# EAGLE schematic MotorControl_M (EAGLE 9.6.2)

## Sheet 1 of 2
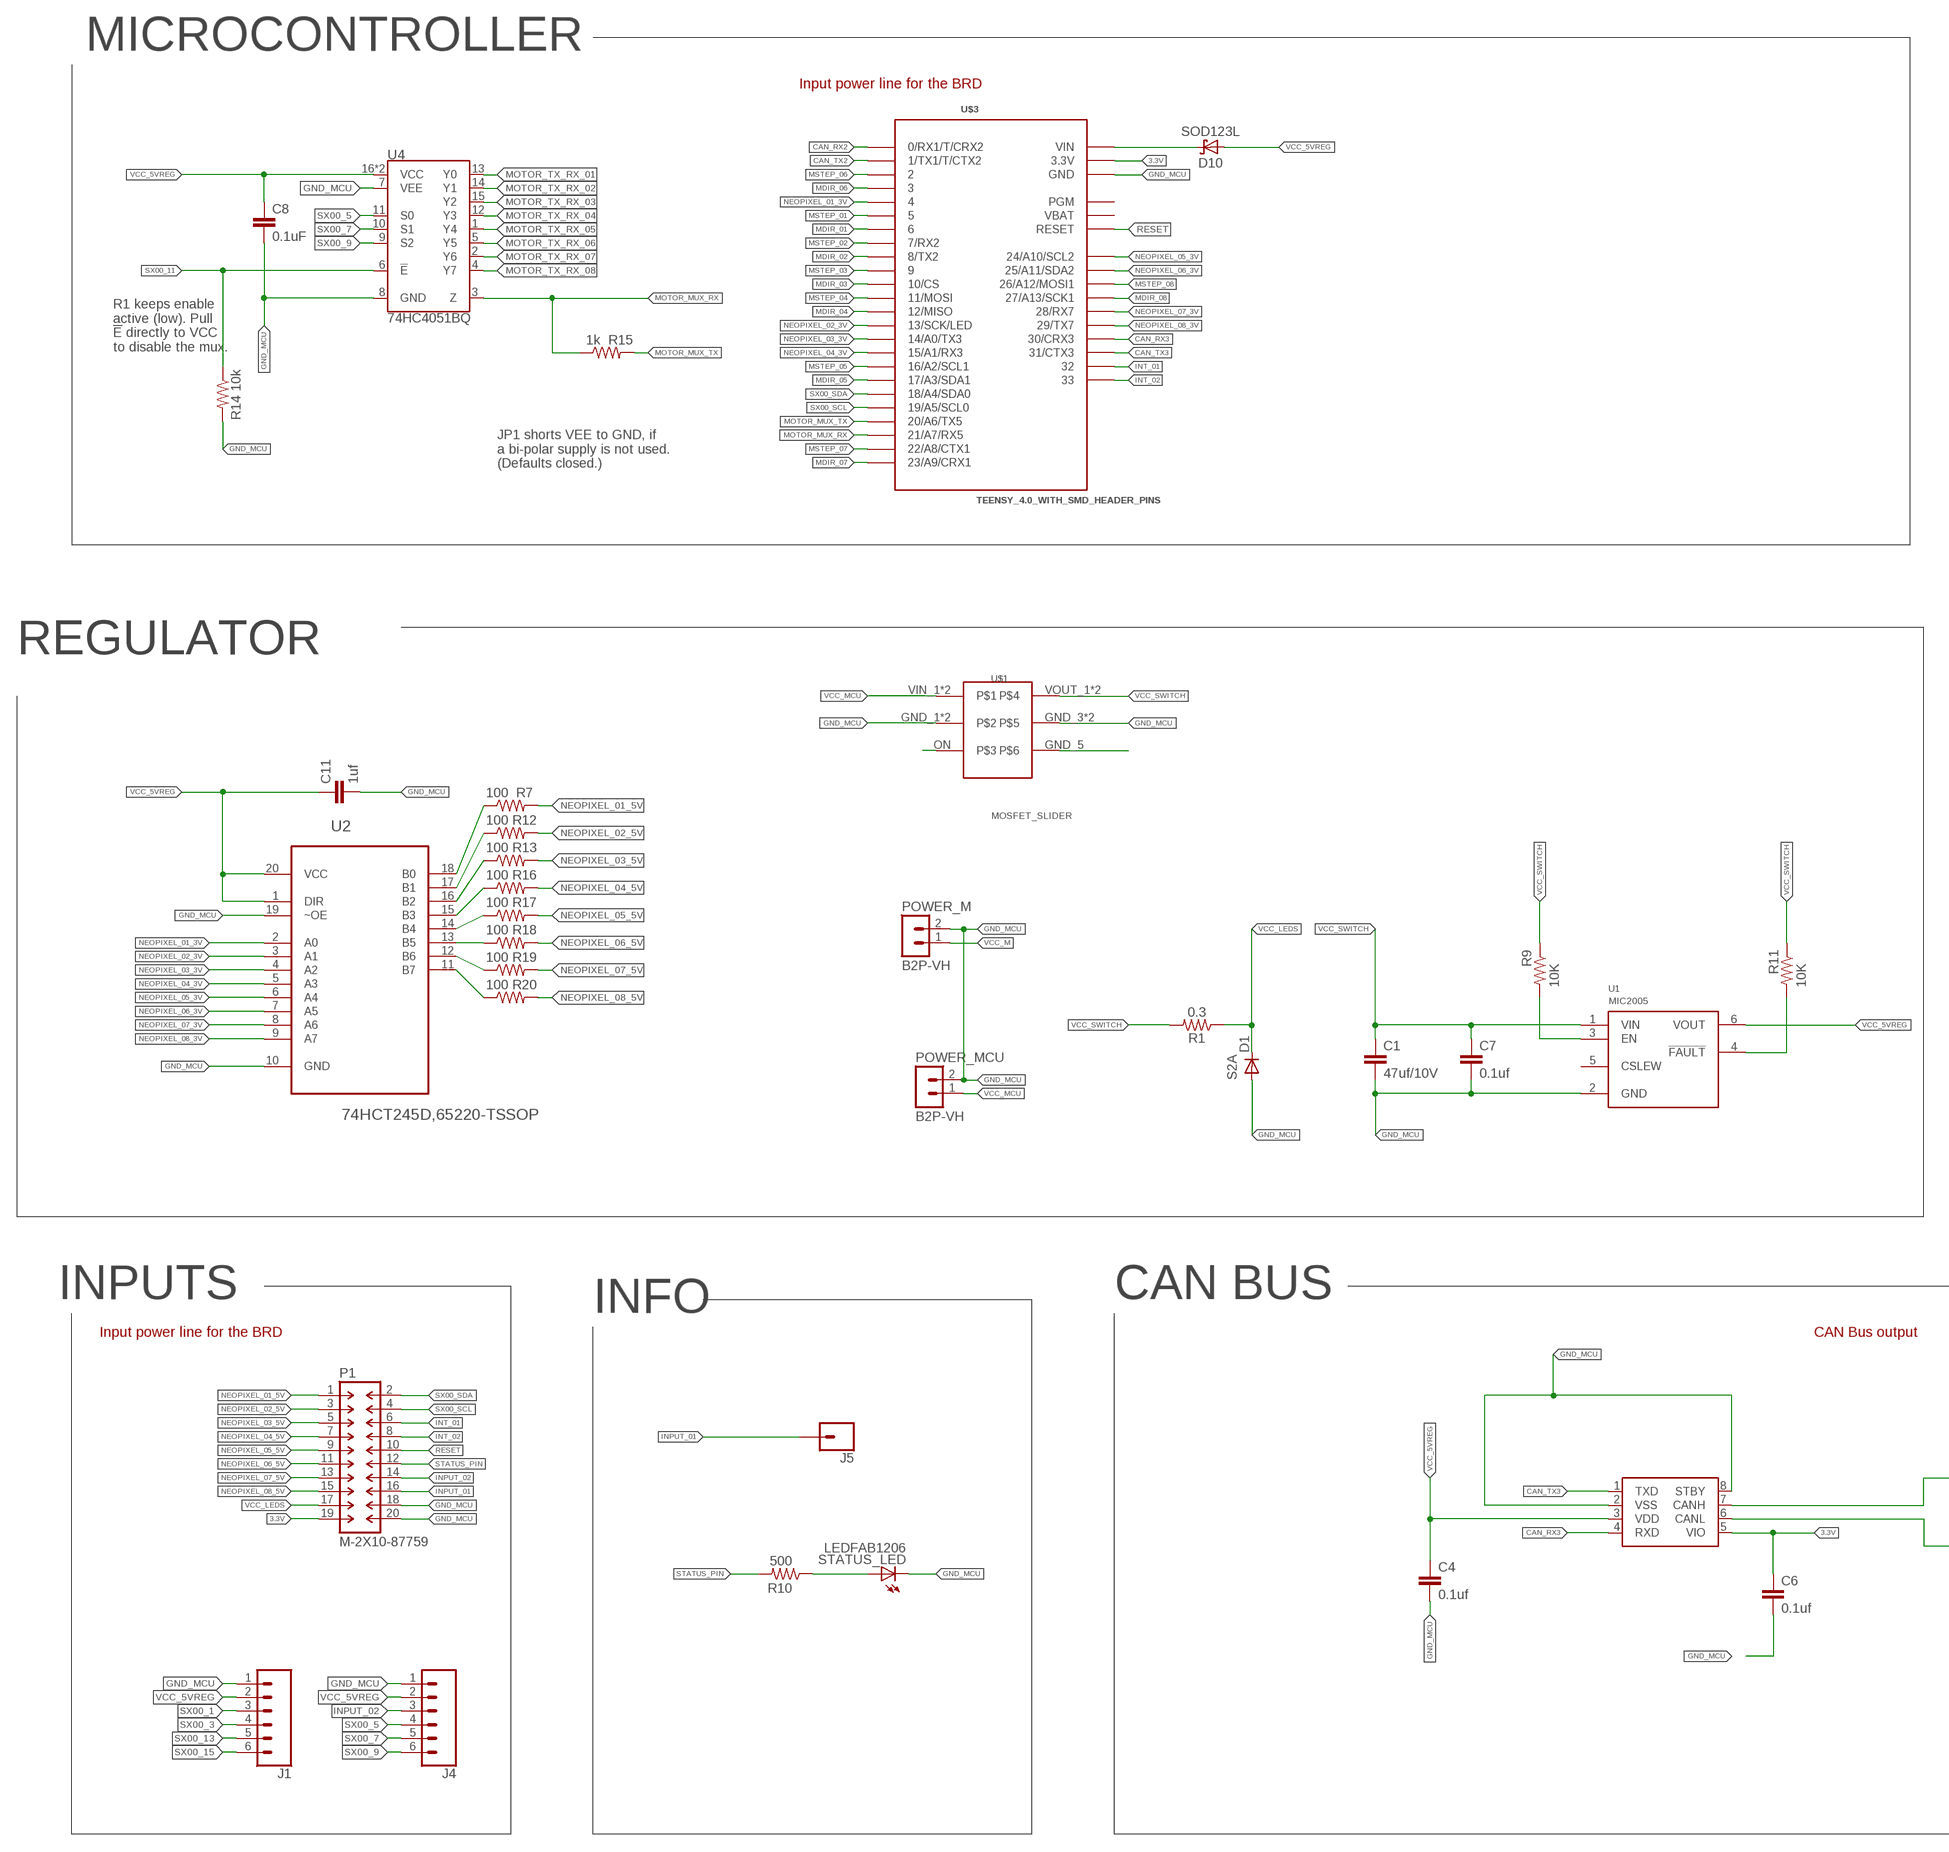
[diagram p0: schematic, sheet 1, part 1 of 3]
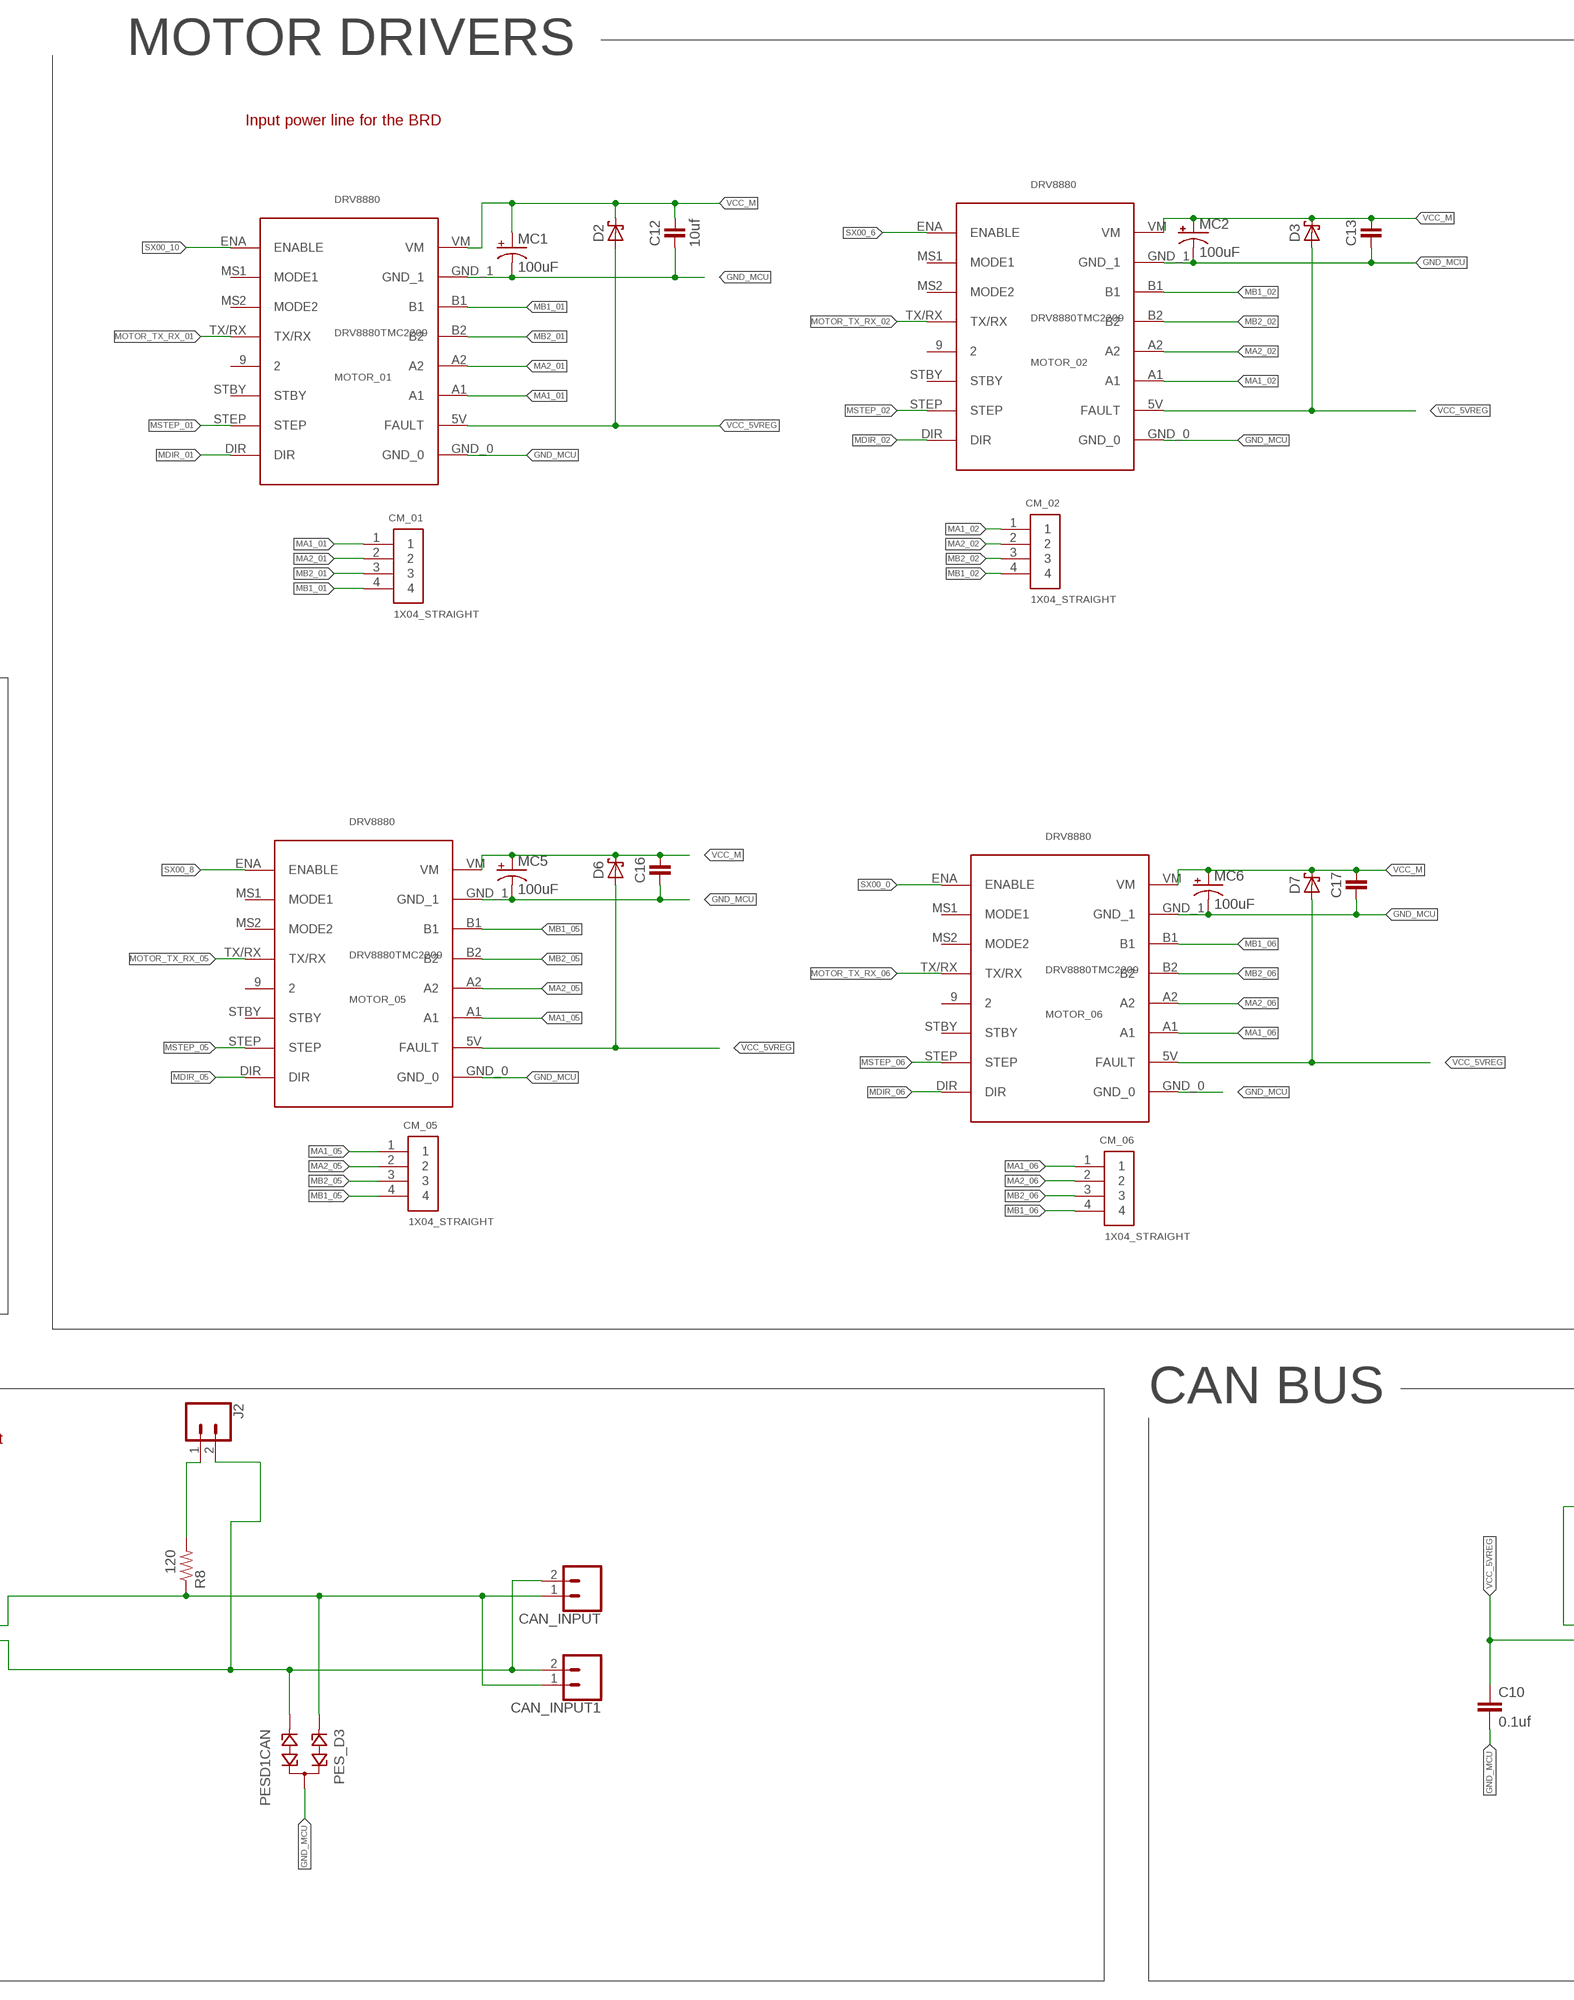
[diagram p1: schematic, sheet 1, part 2 of 3]
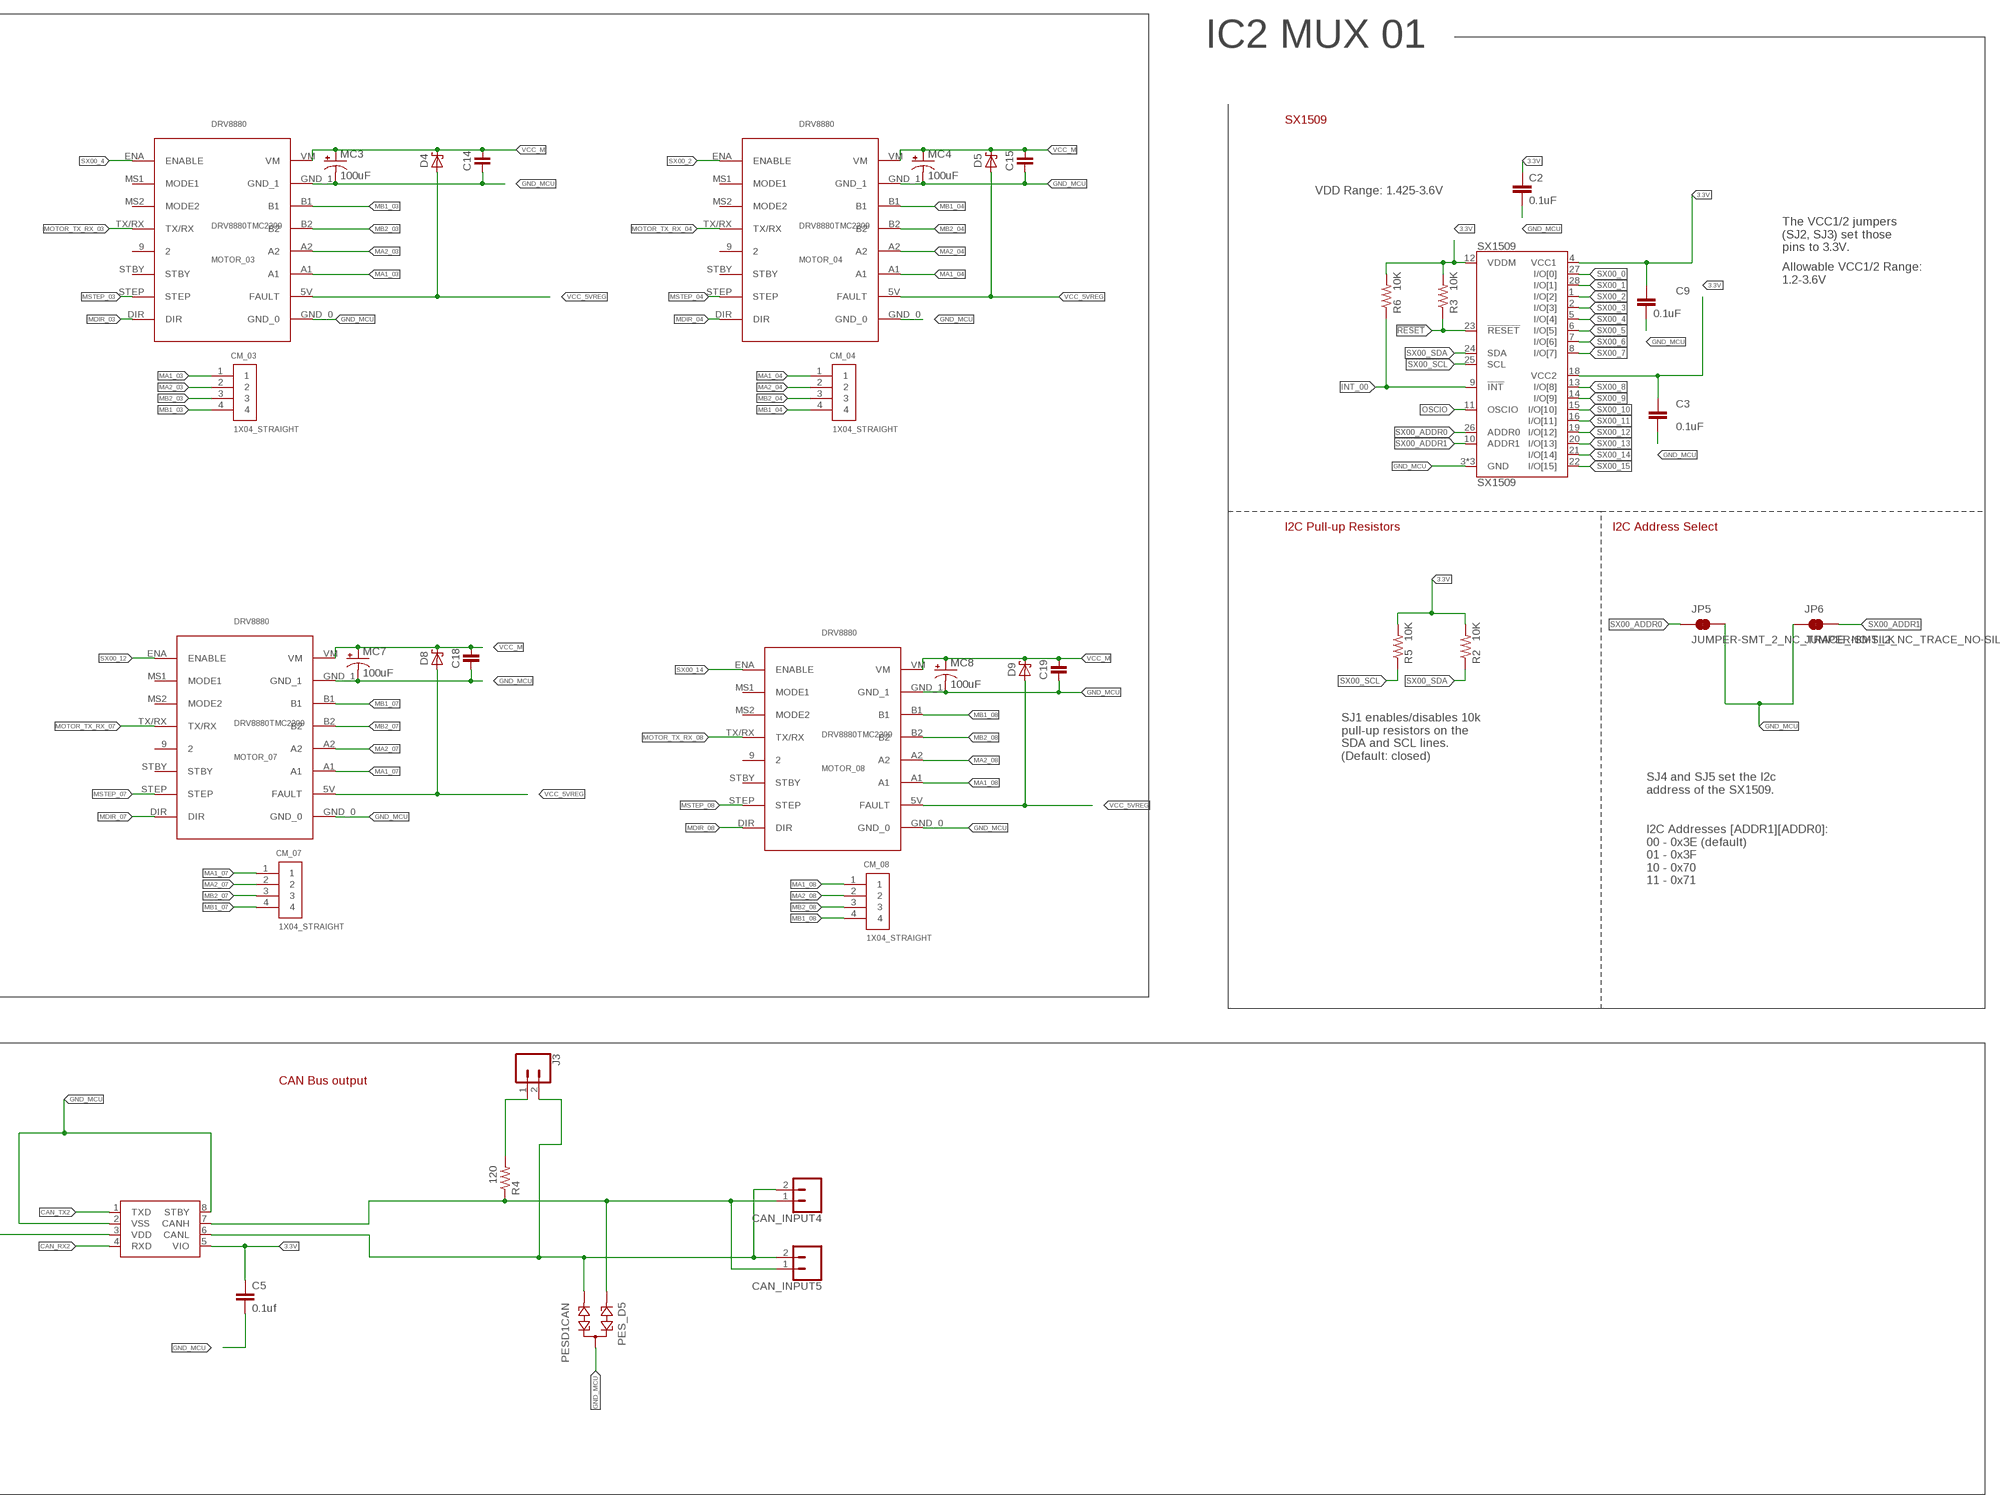
[diagram p2: schematic, sheet 1, part 3 of 3]

### Parts
C1  47uf/10V  0.1UF-25V(+80/-20%)(0603)  [0603-CAP]
C2  0.1uF  0.1UF-25V(+80/-20%)(0603)  [0603-CAP]
C3  0.1uF  0.1UF-25V(+80/-20%)(0603)  [0603-CAP]
C4  0.1uf  0.1UF-25V(+80/-20%)(0603)  [0603-CAP]
C5  0.1uf  0.1UF-25V(+80/-20%)(0603)  [0603-CAP]
C6  0.1uf  0.1UF-25V(+80/-20%)(0603)  [0603-CAP]
C7  0.1uf  0.1UF-25V(+80/-20%)(0603)  [0603-CAP]
C8  0.1uF  0.1UF-0603-25V-(+80/-20%)  [0603]
C9  0.1uF  0.1UF-25V(+80/-20%)(0603)  [0603-CAP]
C10  0.1uf  0.1UF-25V(+80/-20%)(0603)  [0603-CAP]
C11  1uf  0.1UF-25V(+80/-20%)(0603)  [0603-CAP]
C12  10uf  CAPACITOR-1210  [C1210]
C13  CAPACITOR-1210  [C1210]
C14  CAPACITOR-1210  [C1210]
C15  CAPACITOR-1210  [C1210]
C16  CAPACITOR-1210  [C1210]
C17  CAPACITOR-1210  [C1210]
C18  CAPACITOR-1210  [C1210]
C19  CAPACITOR-1210  [C1210]
CAN_INPUT  CONN_02-JST-2MM-SMT  [JST-2-SMD]
CAN_INPUT1  CONN_02-JST-2MM-SMT  [JST-2-SMD]
CAN_INPUT4  CONN_02-JST-2MM-SMT  [JST-2-SMD]
CAN_INPUT5  CONN_02-JST-2MM-SMT  [JST-2-SMD]
CM_01  1X04_STRAIGHT  1X4-CLEANBIG  [1X04-CLEANBIG]
CM_02  1X04_STRAIGHT  1X4-CLEANBIG  [1X04-CLEANBIG]
CM_03  1X04_STRAIGHT  1X4-CLEANBIG  [1X04-CLEANBIG]
CM_04  1X04_STRAIGHT  1X4-CLEANBIG  [1X04-CLEANBIG]
CM_05  1X04_STRAIGHT  1X4-CLEANBIG  [1X04-CLEANBIG]
CM_06  1X04_STRAIGHT  1X4-CLEANBIG  [1X04-CLEANBIG]
CM_07  1X04_STRAIGHT  1X4-CLEANBIG  [1X04-CLEANBIG]
CM_08  1X04_STRAIGHT  1X4-CLEANBIG  [1X04-CLEANBIG]
D1  S2A  [DO214AA]
D2  D_SCHOTTKY-SOD123  [SOD123]
D3  D_SCHOTTKY-SOD123  [SOD123]
D4  D_SCHOTTKY-SOD123  [SOD123]
D5  D_SCHOTTKY-SOD123  [SOD123]
D6  D_SCHOTTKY-SOD123  [SOD123]
D7  D_SCHOTTKY-SOD123  [SOD123]
D8  D_SCHOTTKY-SOD123  [SOD123]
D9  D_SCHOTTKY-SOD123  [SOD123]
D10  SOD123L  D_SCHOTTKY-SOD123  [SOD123]
J1  CONN_06SMD-1MM  [1X06-1MM]
J2  CONN_02  [1X02]
J3  CONN_02  [1X02]
J4  CONN_06SMD-1MM  [1X06-1MM]
J5  CONN_01  [1X01]
JP5  JUMPER-SMT_2_NC_TRACE_NO-SILK  [SMT-JUMPER_2_NC_TRACE_NO-SILK]
JP6  JUMPER-SMT_2_NC_TRACE_NO-SILK  [SMT-JUMPER_2_NC_TRACE_NO-SILK]
MC1  100uF  100UF-POLAR-25V-20%(ELEC)  [PANASONIC_D]
MC2  100uF  100UF-POLAR-25V-20%(ELEC)  [PANASONIC_D]
MC3  100uF  100UF-POLAR-25V-20%(ELEC)  [PANASONIC_D]
MC4  100uF  100UF-POLAR-25V-20%(ELEC)  [PANASONIC_D]
MC5  100uF  100UF-POLAR-25V-20%(ELEC)  [PANASONIC_D]
MC6  100uF  100UF-POLAR-25V-20%(ELEC)  [PANASONIC_D]
MC7  100uF  100UF-POLAR-25V-20%(ELEC)  [PANASONIC_D]
MC8  100uF  100UF-POLAR-25V-20%(ELEC)  [PANASONIC_D]
MCP2562_2.0  MCP2562-E/SN  [SOIC127P600X175-8N]
MCP2562FD  MCP2562-E/SN  [SOIC127P600X175-8N]
MOTOR_01  DRV8880TMC2209  [TMC2209_SMD]
MOTOR_02  DRV8880TMC2209  [TMC2209_SMD]
MOTOR_03  DRV8880TMC2209  [TMC2209_SMD]
MOTOR_04  DRV8880TMC2209  [TMC2209_SMD]
MOTOR_05  DRV8880TMC2209  [TMC2209_SMD]
MOTOR_06  DRV8880TMC2209  [TMC2209_SMD]
MOTOR_07  DRV8880TMC2209  [TMC2209_SMD]
MOTOR_08  DRV8880TMC2209  [TMC2209_SMD]
P1  M-2X10-87759  [87759-20]
PES_D3  PESD1CAN  [SOT23]
PES_D5  PESD1CAN  [SOT23]
POWER_M  B2P-VH  [B2P-VH]
POWER_MCU  B2P-VH  [B2P-VH]
R1  0.3  0.3OHM-0805-1/8W-1%  [0805]
R2  10K  10KOHM-1/10W-1%(0603)0603  [0603-RES]
R3  10K  10KOHM-1/10W-1%(0603)0603  [0603-RES]
R4  120  10KOHM-1/10W-1%(0603)0603  [0603-RES]
R5  10K  10KOHM-1/10W-1%(0603)0603  [0603-RES]
R6  10K  10KOHM-1/10W-1%(0603)0603  [0603-RES]
R7  100  10KOHM-0603-1/10W-1%  [0603]
R8  120  10KOHM-1/10W-1%(0603)0603  [0603-RES]
R9  10K  10KOHM-1/10W-1%(0603)0603  [0603-RES]
R10  500  10KOHM-1/10W-1%(0603)0603  [0603-RES]
R11  10K  10KOHM-1/10W-1%(0603)0603  [0603-RES]
R12  100  10KOHM-0603-1/10W-1%  [0603]
R13  100  10KOHM-0603-1/10W-1%  [0603]
R14  10k  10KOHM-0603-1/10W-1%  [0603]
R15  1k  10KOHM-0603-1/10W-1%  [0603]
R16  100  10KOHM-0603-1/10W-1%  [0603]
R17  100  10KOHM-0603-1/10W-1%  [0603]
R18  100  10KOHM-0603-1/10W-1%  [0603]
R19  100  10KOHM-0603-1/10W-1%  [0603]
R20  100  10KOHM-0603-1/10W-1%  [0603]
STATUS_LED  LEDFAB1206  [LED1206FAB]
SX1509  SX1509  [QFN-28]
U1  MIC2005  [SOT23-6]
U2  74HCT245D,65220-TSSOP  [20-TSSOP]
U4  74HC4051BQ  [DHVQFN-16-2.5X3.5MM]
U$1  MOSFET_SLIDER  [MOSFET_SLIDER]
U$3  TEENSY_4.0_WITH_SMD_HEADER_PINS  [TEENSY_4.0_WITH_SMD_HEADER_PINS]

### Nets
3.3V [vcc]: C2.1 C3.1 C5.1 C6.1 C9.1 MCP2562_2.0.5(VIO) MCP2562FD.5(VIO) P1.19 R2.2 R3.2 R5.2 R6.2 SX1509.4(VCC1) SX1509.12(VDDM) SX1509.18(VCC2) U$3.3.3V U$3.3.3V1(3.3V)
!RESET: R3.1 SX1509.23(!RESET)
CAN_H: CAN_INPUT1.1 CAN_INPUT.1 MCP2562FD.7(CANH) PES_D3.1 R8.1
CAN_H2: CAN_INPUT4.1 CAN_INPUT5.1 MCP2562_2.0.7(CANH) PES_D5.1 R4.1
CAN_L: CAN_INPUT1.2 CAN_INPUT.2 J2.2 MCP2562FD.6(CANL) PES_D3.2
CAN_L2: CAN_INPUT4.2 CAN_INPUT5.2 J3.2 MCP2562_2.0.6(CANL) PES_D5.2
CAN_RX2: MCP2562_2.0.4(RXD) U$3.0(0/RX1/T/CRX2)
CAN_RX3: MCP2562FD.4(RXD) U$3.30(30/CRX3)
CAN_TX2: MCP2562_2.0.1(TXD) U$3.1(1/TX1/T/CTX2)
CAN_TX3: MCP2562FD.1(TXD) U$3.31(31/CTX3)
GND_MCU [gnd]: C1.2 C2.2 C3.2 C4.2 C5.2 C6.2 C7.2 C8.2 C9.2 C10.2 C11.2 C12.1 C13.1 C14.1 C15.1 C16.1 C17.1 C18.1 C19.1 D1.A J1.1 J4.1 JP5.2 JP6.1 MC1.- MC2.- MC3.- MC4.- MC5.- MC6.- MC7.- MC8.- MCP2562_2.0.2(VSS) MCP2562_2.0.8(STBY) MCP2562FD.2(VSS) MCP2562FD.8(STBY) MOTOR_01.GND_0 MOTOR_01.GND_1 MOTOR_02.GND_0 MOTOR_02.GND_1 MOTOR_03.GND_0 MOTOR_03.GND_1 MOTOR_04.GND_0 MOTOR_04.GND_1 MOTOR_05.GND_0 MOTOR_05.GND_1 MOTOR_06.GND_0 MOTOR_06.GND_1 MOTOR_07.GND_0 MOTOR_07.GND_1 MOTOR_08.GND_0 MOTOR_08.GND_1 P1.18 P1.20 PES_D3.3 PES_D5.3 POWER_M.2 POWER_MCU.2 R14.2 STATUS_LED.2(C) SX1509.3(GND) SX1509.17(GND) SX1509.29(GND) U1.2(GND) U2.10(GND) U2.19(~OE) U4.7(VEE) U4.8(GND) U$1.GND_1 U$1.GND_2 U$1.GND_3 U$1.GND_4 U$3.GND U$3.GND1(GND) U$3.GND2(GND)
INPUT_01: J5.1 P1.16
INPUT_02: J4.3 P1.14
INT_00: R6.1 SX1509.9(!INT)
INT_01: P1.6 U$3.32
INT_02: P1.8 U$3.33
MA1_01 [vcc5]: CM_01.1 MOTOR_01.A1
MA1_02 [vcc5]: CM_02.1 MOTOR_02.A1
MA1_03 [vcc5]: CM_03.1 MOTOR_03.A1
MA1_04 [vcc5]: CM_04.1 MOTOR_04.A1
MA1_05 [vcc5]: CM_05.1 MOTOR_05.A1
MA1_06 [vcc5]: CM_06.1 MOTOR_06.A1
MA1_07 [vcc5]: CM_07.1 MOTOR_07.A1
MA1_08 [vcc5]: CM_08.1 MOTOR_08.A1
MA2_01 [vcc5]: CM_01.2 MOTOR_01.A2
MA2_02 [vcc5]: CM_02.2 MOTOR_02.A2
MA2_03 [vcc5]: CM_03.2 MOTOR_03.A2
MA2_04 [vcc5]: CM_04.2 MOTOR_04.A2
MA2_05 [vcc5]: CM_05.2 MOTOR_05.A2
MA2_06 [vcc5]: CM_06.2 MOTOR_06.A2
MA2_07 [vcc5]: CM_07.2 MOTOR_07.A2
MA2_08 [vcc5]: CM_08.2 MOTOR_08.A2
MB1_01 [vcc5]: CM_01.4 MOTOR_01.B1
MB1_02 [vcc5]: CM_02.4 MOTOR_02.B1
MB1_03 [vcc5]: CM_03.4 MOTOR_03.B1
MB1_04 [vcc5]: CM_04.4 MOTOR_04.B1
MB1_05 [vcc5]: CM_05.4 MOTOR_05.B1
MB1_06 [vcc5]: CM_06.4 MOTOR_06.B1
MB1_07 [vcc5]: CM_07.4 MOTOR_07.B1
MB1_08 [vcc]: CM_08.4 MOTOR_08.B1
MB2_01 [vcc5]: CM_01.3 MOTOR_01.B2
MB2_02 [vcc5]: CM_02.3 MOTOR_02.B2
MB2_03 [vcc5]: CM_03.3 MOTOR_03.B2
MB2_04 [vcc5]: CM_04.3 MOTOR_04.B2
MB2_05 [vcc5]: CM_05.3 MOTOR_05.B2
MB2_06 [vcc5]: CM_06.3 MOTOR_06.B2
MB2_07 [vcc5]: CM_07.3 MOTOR_07.B2
MB2_08 [vcc5]: CM_08.3 MOTOR_08.B2
MDIR_01: MOTOR_01.DIR U$3.6
MDIR_02: MOTOR_02.DIR U$3.8(8/TX2)
MDIR_03: MOTOR_03.DIR U$3.10(10/CS)
MDIR_04: MOTOR_04.DIR U$3.12(12/MISO)
MDIR_05: MOTOR_05.DIR U$3.17/A3(17/A3/SDA1)
MDIR_06: MOTOR_06.DIR U$3.3
MDIR_07: MOTOR_07.DIR U$3.23/A9(23/A9/CRX1)
MDIR_08: MOTOR_08.DIR U$3.27(27/A13/SCK1)
MOTOR_MUX_RX: R15.1 U4.3(Z) U$3.21/A7(21/A7/RX5)
MOTOR_MUX_TX: R15.2 U$3.20/A6(20/A6/TX5)
MOTOR_TX_RX_01: MOTOR_01.TX/RX U4.13(Y0)
MOTOR_TX_RX_02: MOTOR_02.TX/RX U4.14(Y1)
MOTOR_TX_RX_03: MOTOR_03.TX/RX U4.15(Y2)
MOTOR_TX_RX_04: MOTOR_04.TX/RX U4.12(Y3)
MOTOR_TX_RX_05: MOTOR_05.TX/RX U4.1(Y4)
MOTOR_TX_RX_06: MOTOR_06.TX/RX U4.5(Y5)
MOTOR_TX_RX_07: MOTOR_07.TX/RX U4.2(Y6)
MOTOR_TX_RX_08: MOTOR_08.TX/RX U4.4(Y7)
MSTEP_01: MOTOR_01.STEP U$3.5
MSTEP_02: MOTOR_02.STEP U$3.7(7/RX2)
MSTEP_03: MOTOR_03.STEP U$3.9
MSTEP_04: MOTOR_04.STEP U$3.11(11/MOSI)
MSTEP_05: MOTOR_05.STEP U$3.16/A2(16/A2/SCL1)
MSTEP_06: MOTOR_06.STEP U$3.2
MSTEP_07: MOTOR_07.STEP U$3.22/A8(22/A8/CTX1)
MSTEP_08: MOTOR_08.STEP U$3.26(26/A12/MOSI1)
N$1: J2.1 R8.2
N$2: U$1.ON
N$3: J3.1 R4.2
N$5: D10.C U$3.VIN
N$6: R7.1 U2.18(B0)
N$7: U$1.GND_5
N$8: R12.1 U2.17(B1)
N$9: R13.1 U2.16(B2)
N$10: R11.2 U1.4(!FAULT)
N$11: R16.1 U2.15(B3)
N$12: R17.1 U2.14(B4)
N$13: R9.2 U1.3(EN)
N$14: R18.1 U2.13(B5)
N$15: R19.1 U2.12(B6)
N$16: R20.1 U2.11(B7)
N$193: R10.1 STATUS_LED.1(A)
NEOPIXEL_01_3V: U2.2(A0) U$3.4
NEOPIXEL_01_5V: P1.1 R7.2
NEOPIXEL_02_3V: U2.3(A1) U$3.13(13/SCK/LED)
NEOPIXEL_02_5V: P1.3 R12.2
NEOPIXEL_03_3V: U2.4(A2) U$3.14/A0(14/A0/TX3)
NEOPIXEL_03_5V: P1.5 R13.2
NEOPIXEL_04_3V: U2.5(A3) U$3.15/A1(15/A1/RX3)
NEOPIXEL_04_5V: P1.7 R16.2
NEOPIXEL_05_3V: U2.6(A4) U$3.24(24/A10/SCL2)
NEOPIXEL_05_5V: P1.9 R17.2
NEOPIXEL_06_3V: U2.7(A5) U$3.25(25/A11/SDA2)
NEOPIXEL_06_5V: P1.11 R18.2
NEOPIXEL_07_3V: U2.8(A6) U$3.28(28/RX7)
NEOPIXEL_07_5V: P1.13 R19.2
NEOPIXEL_08_3V: U2.9(A7) U$3.29(29/TX7)
NEOPIXEL_08_5V: P1.15 R20.2
OSCIO: SX1509.11(OSCIO)
RESET: P1.10 U$3.RESET
STATUS_PIN: P1.12 R10.2
SX00_0: MOTOR_06.ENA(ENABLE) SX1509.27(I/O[0])
SX00_1: J1.3 SX1509.28(I/O[1])
SX00_2: MOTOR_04.ENA(ENABLE) SX1509.1(I/O[2])
SX00_3: J1.4 SX1509.2(I/O[3])
SX00_4: MOTOR_03.ENA(ENABLE) SX1509.5(I/O[4])
SX00_5: J4.4 SX1509.6(I/O[5]) U4.11(S0)
SX00_6: MOTOR_02.ENA(ENABLE) SX1509.7(I/O[6])
SX00_7: J4.5 SX1509.8(I/O[7]) U4.10(S1)
SX00_8: MOTOR_05.ENA(ENABLE) SX1509.13(I/O[8])
SX00_9: J4.6 SX1509.14(I/O[9]) U4.9(S2)
SX00_10: MOTOR_01.ENA(ENABLE) SX1509.15(I/O[10])
SX00_11: R14.1 SX1509.16(I/O[11]) U4.6(!E!)
SX00_12: MOTOR_07.ENA(ENABLE) SX1509.19(I/O[12])
SX00_13: J1.5 SX1509.20(I/O[13])
SX00_14: MOTOR_08.ENA(ENABLE) SX1509.21(I/O[14])
SX00_15: J1.6 SX1509.22(I/O[15])
SX00_ADDR0: JP5.1 SX1509.26(ADDR0)
SX00_ADDR1: JP6.2 SX1509.10(ADDR1)
SX00_SCL: P1.4 R5.1 SX1509.25(SCL) U$3.19/A5(19/A5/SCL0)
SX00_SDA: P1.2 R2.1 SX1509.24(SDA) U$3.18/A4(18/A4/SDA0)
VCC_5VREG [vcc]: C4.1 C8.1 C10.1 C11.1 D2.A D3.A D4.A D5.A D6.A D7.A D8.A D9.A D10.A J1.2 J4.2 MCP2562_2.0.3(VDD) MCP2562FD.3(VDD) MOTOR_01.5V(FAULT) MOTOR_02.5V(FAULT) MOTOR_03.5V(FAULT) MOTOR_04.5V(FAULT) MOTOR_05.5V(FAULT) MOTOR_06.5V(FAULT) MOTOR_07.5V(FAULT) MOTOR_08.5V(FAULT) U1.6(VOUT) U2.1(DIR) U2.20(VCC) U4.16(VCC) U4.EP(VCC)
VCC_LEDS: D1.C P1.17 R1.1
VCC_M [vcc5]: C12.2 C13.2 C14.2 C15.2 C16.2 C17.2 C18.2 C19.2 D2.C D3.C D4.C D5.C D6.C D7.C D8.C D9.C MC1.+ MC2.+ MC3.+ MC4.+ MC5.+ MC6.+ MC7.+ MC8.+ MOTOR_01.VM MOTOR_02.VM MOTOR_03.VM MOTOR_04.VM MOTOR_05.VM MOTOR_06.VM MOTOR_07.VM MOTOR_08.VM POWER_M.1
VCC_MCU [vcc]: POWER_MCU.1 U$1.VIN_1 U$1.VIN_2
VCC_SWITCH [vcc]: C1.1 C7.1 R1.2 R9.1 R11.1 U1.1(VIN) U$1.VOUT_1 U$1.VOUT_2
Unconnected: MOTOR_01.9 MOTOR_01.MS1(MODE1) MOTOR_01.MS2(MODE2) MOTOR_01.STBY MOTOR_02.9 MOTOR_02.MS1(MODE1) MOTOR_02.MS2(MODE2) MOTOR_02.STBY MOTOR_03.9 MOTOR_03.MS1(MODE1) MOTOR_03.MS2(MODE2) MOTOR_03.STBY MOTOR_04.9 MOTOR_04.MS1(MODE1) MOTOR_04.MS2(MODE2) MOTOR_04.STBY MOTOR_05.9 MOTOR_05.MS1(MODE1) MOTOR_05.MS2(MODE2) MOTOR_05.STBY MOTOR_06.9 MOTOR_06.MS1(MODE1) MOTOR_06.MS2(MODE2) MOTOR_06.STBY MOTOR_07.9 MOTOR_07.MS1(MODE1) MOTOR_07.MS2(MODE2) MOTOR_07.STBY MOTOR_08.9 MOTOR_08.MS1(MODE1) MOTOR_08.MS2(MODE2) MOTOR_08.STBY U1.5(CSLEW) U$3.PGM

### Notes on the sheet
- MICROCONTROLLER | MOTOR DRIVERS
- Input power line for the BRD | IC2 MUX 01
- Input power line for the BRD
- SX1509
- VDD Range: 1.425-3.6V
- R1 keeps enable 
  active (low). Pull 
  !E! directly to VCC 
  to disable the mux.
- The VCC1/2 jumpers 
  (SJ2, SJ3) set those 
  pins to 3.3V.
- Allowable VCC1/2 Range: 
  1.2-3.6V
- JP1 shorts VEE to GND, if 
  a bi-polar supply is not used.
  (Defaults closed.)
- REGULATOR | I2C Pull-up Resistors | I2C Address Select
- SJ1 enables/disables 10k
  pull-up resistors on the
  SDA and SCL lines.
  (Default: closed)
- SJ4 and SJ5 set the I2c
  address of the SX1509.
- I2C Addresses [ADDR1][ADDR0]:
  00 - 0x3E (default)
  01 - 0x3F
  10 - 0x70
  11 - 0x71
- INPUTS | INFO | CAN BUS | CAN BUS
- Input power line for the BRD | CAN Bus output | CAN Bus output

## Sheet 2 of 2

## Power pins joined to a net without a drawn wire
VBAT: U$3.VBAT

## Library data of the parts
C1 C4-C7 C10 C11 = SparkFun-Capacitors:0.1UF-25V(+80/-20%)(0603): CAP-00810 Ceramic Standard decoupling cap; PROD_ID: CAP-00810; VALUE: 0.1uF
C2 C3 C9 = SparkFun-Capacitors:0.1UF-25V(+80/-20%)(0603): CAP-00810 Ceramic Standard decoupling cap; PROD_ID: CAP-00810
C8 = SparkFun-Capacitors:0.1UF: 0.1µF ceramic capacitors A capacitor is a passive two-terminal electrical component used to store electrical energy temporarily in an electric field.; PROD_ID: CAP-00810
C12-C19 = we-rcl:CAPACITOR: Capacitor ...2.2uF @ 6.3V -> 0402 ...4.7uF @ 6.3V -> 0603 ...10uF @ 16V -> 0805 ...22uF @ 25V -> 1206
CAN_INPUT CAN_INPUT1 CAN_INPUT4 CAN_INPUT5 = SparkFun-Connectors:CONN_02: Multi connection point. Often used as Generic Header-pin footprint for 0.1 inch spaced/style header connections On any of the 0.1 inch spaced packages, you can populate with these: Break Away Headers - Straight <https://www.sparkfun.com/products/116> (PRT-00116) Break Away Male Headers - Right Angle <https://www.sparkfun.com/products/553> (PRT-00553) Female Headers <https://www.sparkfun.com/products/115> (PRT-00115) Break Away Headers - Machine Pin <https://www.sparkfun.com/products/117> (PRT-00117) Break Away Female Headers - Swiss Machine Pin <https://www.sparkfun.com/products/743> (PRT-00743) For SCREWTERMINALS and SPRING TERMINALS visit here: Screw Terimnals on SparkFun.com <https://www.sparkfun.com/search/results?term=Screw+Terminals> (5mm/3.5mm/2.54mm spacing) This device is also useful as a general connection point to wire up your design to another part of your project. Our various solder wires solder well into these plated through hole pads. Hook-Up Wire - Assortment (Stranded, 22 AWG) <https://www.sparkfun.com/products/11375> (PRT-11375) Hook-Up Wire - Assortment (Solid Core, 22 AWG) <https://www.sparkfun.com/products/11367> (PRT-11367) View the entire wire category on our website here <https://www.sparkfun.com/categories/141> Special notes: Molex polarized connector foot print use with: PRT-08233 with associated crimp pins and housings. 2.54_SCREWTERM for use with PRT-10571. 3.5mm Screw Terminal footprints for PRT-08084 5mm Screw Terminal footprints for use with PRT-08432; PROD_ID: CONN-11443
CM_01-CM_08 = adafruit:1X4: 4-pin connector
D1 = s2x_10:S2*: S2A - S2M General Purpose Rectifiers Source: http://www.fairchildsemi.com/datasheets/S2/S2A.pdf; MF: Fairchild; MPN: S2A; OC_FARNELL: 1467485; OC_NEWARK: 58K2391
D2-D10 = we-rcl:D_SCHOTTKY: Schottky Diode 1A, 30V - SOD323 (BAS3010B) 3A, 100V - SOD123 (S310A)
J1 J4 = SparkFun-Connectors:CONN_06: Multi connection point. Often used as Generic Header-pin footprint for 0.1 inch spaced/style header connections On any of the 0.1 inch spaced packages, you can populate with these: Break Away Headers - Straight <https://www.sparkfun.com/products/116> (PRT-00116) Break Away Male Headers - Right Angle <https://www.sparkfun.com/products/553> (PRT-00553) Female Headers <https://www.sparkfun.com/products/115> (PRT-00115) Break Away Headers - Machine Pin <https://www.sparkfun.com/products/117> (PRT-00117) Break Away Female Headers - Swiss Machine Pin <https://www.sparkfun.com/products/743> (PRT-00743) Arduino Stackable Header - 6 Pin <https://www.sparkfun.com/products/9280> (PRT-09280) For SCREWTERMINALS and SPRING TERMINALS visit here: Screw Terimnals on SparkFun.com <https://www.sparkfun.com/search/results?term=Screw+Terminals> (5mm/3.5mm/2.54mm spacing) This device is also useful as a general connection point to wire up your design to another part of your project. Our various solder wires solder well into these plated through hole pads. Hook-Up Wire - Assortment (Stranded, 22 AWG) <https://www.sparkfun.com/products/11375> (PRT-11375) Hook-Up Wire - Assortment (Solid Core, 22 AWG) <https://www.sparkfun.com/products/11367> (PRT-11367) View the entire wire category on our website here <https://www.sparkfun.com/categories/141>; PROD_ID: CONN-08249; SF_ID: GPS-00579
J2 J3 = SparkFun-Connectors:CONN_02: Multi connection point. Often used as Generic Header-pin footprint for 0.1 inch spaced/style header connections On any of the 0.1 inch spaced packages, you can populate with these: Break Away Headers - Straight <https://www.sparkfun.com/products/116> (PRT-00116) Break Away Male Headers - Right Angle <https://www.sparkfun.com/products/553> (PRT-00553) Female Headers <https://www.sparkfun.com/products/115> (PRT-00115) Break Away Headers - Machine Pin <https://www.sparkfun.com/products/117> (PRT-00117) Break Away Female Headers - Swiss Machine Pin <https://www.sparkfun.com/products/743> (PRT-00743) For SCREWTERMINALS and SPRING TERMINALS visit here: Screw Terimnals on SparkFun.com <https://www.sparkfun.com/search/results?term=Screw+Terminals> (5mm/3.5mm/2.54mm spacing) This device is also useful as a general connection point to wire up your design to another part of your project. Our various solder wires solder well into these plated through hole pads. Hook-Up Wire - Assortment (Stranded, 22 AWG) <https://www.sparkfun.com/products/11375> (PRT-11375) Hook-Up Wire - Assortment (Solid Core, 22 AWG) <https://www.sparkfun.com/products/11367> (PRT-11367) View the entire wire category on our website here <https://www.sparkfun.com/categories/141> Special notes: Molex polarized connector foot print use with: PRT-08233 with associated crimp pins and housings. 2.54_SCREWTERM for use with PRT-10571. 3.5mm Screw Terminal footprints for PRT-08084 5mm Screw Terminal footprints for use with PRT-08432
J5 = SparkFun-Connectors:CONN_01: Single connection point. Often used as Generic Header-pin footprint for 0.1 inch spaced/style header connections On any of the 0.1 inch spaced packages, you can populate with these: Break Away Headers - Straight <https://www.sparkfun.com/products/116> (PRT-00116) Break Away Male Headers - Right Angle <https://www.sparkfun.com/products/553> (PRT-00553) Female Headers <https://www.sparkfun.com/products/115> (PRT-00115) Break Away Headers - Machine Pin <https://www.sparkfun.com/products/117> (PRT-00117) Break Away Female Headers - Swiss Machine Pin <https://www.sparkfun.com/products/743> (PRT-00743) This device is also useful as a general connection point to wire up your design to another part of your project. Our various solder wires solder well into these plated through hole pads. Hook-Up Wire - Assortment (Stranded, 22 AWG) <https://www.sparkfun.com/products/11375> (PRT-11375) Hook-Up Wire - Assortment (Solid Core, 22 AWG) <https://www.sparkfun.com/products/11367> (PRT-11367) View the entire wire category on our website here <https://www.sparkfun.com/categories/141> Special notes: SMTSO-256-ET is a "flush mount" nut for a 4-40 screw. We mostly use this on specialty testbeds; it is a nice way to connect hardware to your PCB at an adjustable hieght. Also note, the SNAP packages are for using a snappable style connector. We sell a baggie of snaps and they are also used on two LilyPad designs: Snap Assortment - 30 pack (male and female) <https://www.sparkfun.com/products/11347> (DEV-11347) LilyPad Arduino SimpleSnap <https://www.sparkfun.com/products/10941> (DEV-10941) LilyPad SimpleSnap Protoboard <https://www.sparkfun.com/products/10940> (DEV-10940)
JP5 JP6 = SparkFun-Jumpers:JUMPER-SMT_2_NC_TRACE: Normally closed trace jumper This jumper has a trace between two pads so it's normally closed (NC). Use a razor knife to open the connection. For best results follow the IPC guidelines for cutting traces: Cutout at least 0.063 mm (0.005 in). Remove all loose material to clean up the cut area. Seal the cut with an approved epoxy. Reapply solder to reclose the connection.
MC1-MC8 = SparkFun-Capacitors:100UF-POLAR: 100µF polarized capacitors A capacitor is a passive two-terminal electrical component used to store electrical energy temporarily in an electric field.; PROD_ID: CAP-12547
MCP2562_2.0 MCP2562FD = MCP2562-E_SN:MCP2562-E/SN: MCP2562 Series 5 V Surface Mount High-Speed CAN Transceiver - SOIC-8 Check prices <https://pricing.snapeda.com/parts/MCP2562-E/SN/Microchip/view-part?ref=eda>; AVAILABILITY: Good; DESCRIPTION: 1/1 Transceiver Half CANbus 8-SOIC; MF: Microchip; MP: MCP2562-E/SN; PACKAGE: SO-8 Microchip; PRICE: None; PURCHASE-URL: https://pricing.snapeda.com/search/part/MCP2562-E/SN/?ref=eda
MOTOR_01-MOTOR_08 = STSPIN220:DRV8880
P1 = con-headers-jp:M-2X10-: MALE HEADER
PES_D3 PES_D5 = diode:PESD1CAN: CAN bus ESD protection diode Source: http://www.nxp.com/documents/data_sheet/PESD1CAN.pdf
POWER_M POWER_MCU = con-JST VH:B2P-VH: JST VH Series header 3.96mm pitch disconnectable crimp style connectors, vertical (side entry type), 2 pins
R1 = SparkFun-Resistors:0.3OHM: 0.3Ω resistor A resistor is a passive two-terminal electrical component that implements electrical resistance as a circuit element. Resistors act to reduce current flow, and, at the same time, act to lower voltage levels within circuits. - Wikipedia; PROD_ID: RES-11622
R2 R3 R5 R6 R9 R11 = SparkFun-Resistors:10KOHM-1/10W-1%(0603): RES-00824; PROD_ID: RES-00824
R4 R8 R10 = SparkFun-Resistors:10KOHM-1/10W-1%(0603): RES-00824; PROD_ID: RES-00824; VALUE: 10K
R7 R12 R13 R15-R20 = SparkFun-Resistors:10KOHM: 10kΩ resistor A resistor is a passive two-terminal electrical component that implements electrical resistance as a circuit element. Resistors act to reduce current flow, and, at the same time, act to lower voltage levels within circuits.; PROD_ID: RES-00824; VALUE: 10k
R14 = SparkFun-Resistors:10KOHM: 10kΩ resistor A resistor is a passive two-terminal electrical component that implements electrical resistance as a circuit element. Resistors act to reduce current flow, and, at the same time, act to lower voltage levels within circuits.; PROD_ID: RES-00824
STATUS_LED = fab:LED: LED
SX1509 = SparkFun-DigitalIC:SX1509: Semtech SX1509 The SX1509 is a complete ultra low voltage 1.2V to 3.6V General Purpose parallel Input/Output (GPIO) expanders ideal for low power handheld battery powered equipment. This version comes in a 16-channel configuration and allows easy serial expansion of I/O through a standard 400kHz I2C interface. GPIO devices can provide additional control and monitoring when the microcontroller or chipset has insufficient I/O ports, or in systems where serial communication and control from a remote location is advantageous.; PROD_ID: IC-11311
U1 = Microchip:MIC20*5
U2 = 74HCT245D_652:74HCT245D,652: Octal bus transceiver Check prices <https://pricing.snapeda.com/parts/74HCT245D%2C652/Nexperia/view-part?ref=eda>
U4 = 8mux:74HC4051: NXP 74HC4051 8-Channel Analog Multiplexer/Demultiplexer The 74HC4051; 74HCT4051 is a single-pole octal-throw analog switch (SP8T) suitable for use in analog or digital 8:1 multiplexer/demultiplexer applications. The switch features three digital select inputs (S0, S1 and S2), eight independent inputs/outputs (Yn), a common input/output (Z) and a digital enable input (E). When E is HIGH, the switches are turned off. Inputs include clamp diodes. This enables the use of current limiting resistors to interface inputs to voltages in excess of VCC. Datasheet <http://www.nxp.com/documents/data_sheet/74HC_HCT4051.pdf>; PROD_ID: IC-13334
U$1 = Mosfet_slider:MOSFET_SLIDER
U$3 = Teensy4:TEENSY_4.0_WITH_SMD_HEADER_PINS: Footprint for Teensy 3.1 or 3.2 board using all pin connections on the outer perimeter

## Net classes
0 default: drill 0.35 mm, clearance 0.2 mm
1 gnd: width 0.2 mm, drill 0.508 mm, clearance 0.2 mm
3 vcc: width 0.2 mm, drill 0.508 mm, clearance 0.2 mm
4 vcc5: width 0.55 mm, drill 0.508 mm, clearance 0.2 mm